# Altium schematic sheet RcMPPT-Debug.SchDoc: RcMPPT-Debug
size A4; Author: Thomas Hofmann; CompanyName: HTL St. Pölten; Organization: Altium Limited; Address1: RcMPPT; Address2: Frenchs Forest; Address3: NSW; Address4: Australia 2086; DocumentNumber: 6; Revision: 2.0; SheetNumber: 6; SheetTotal: 8
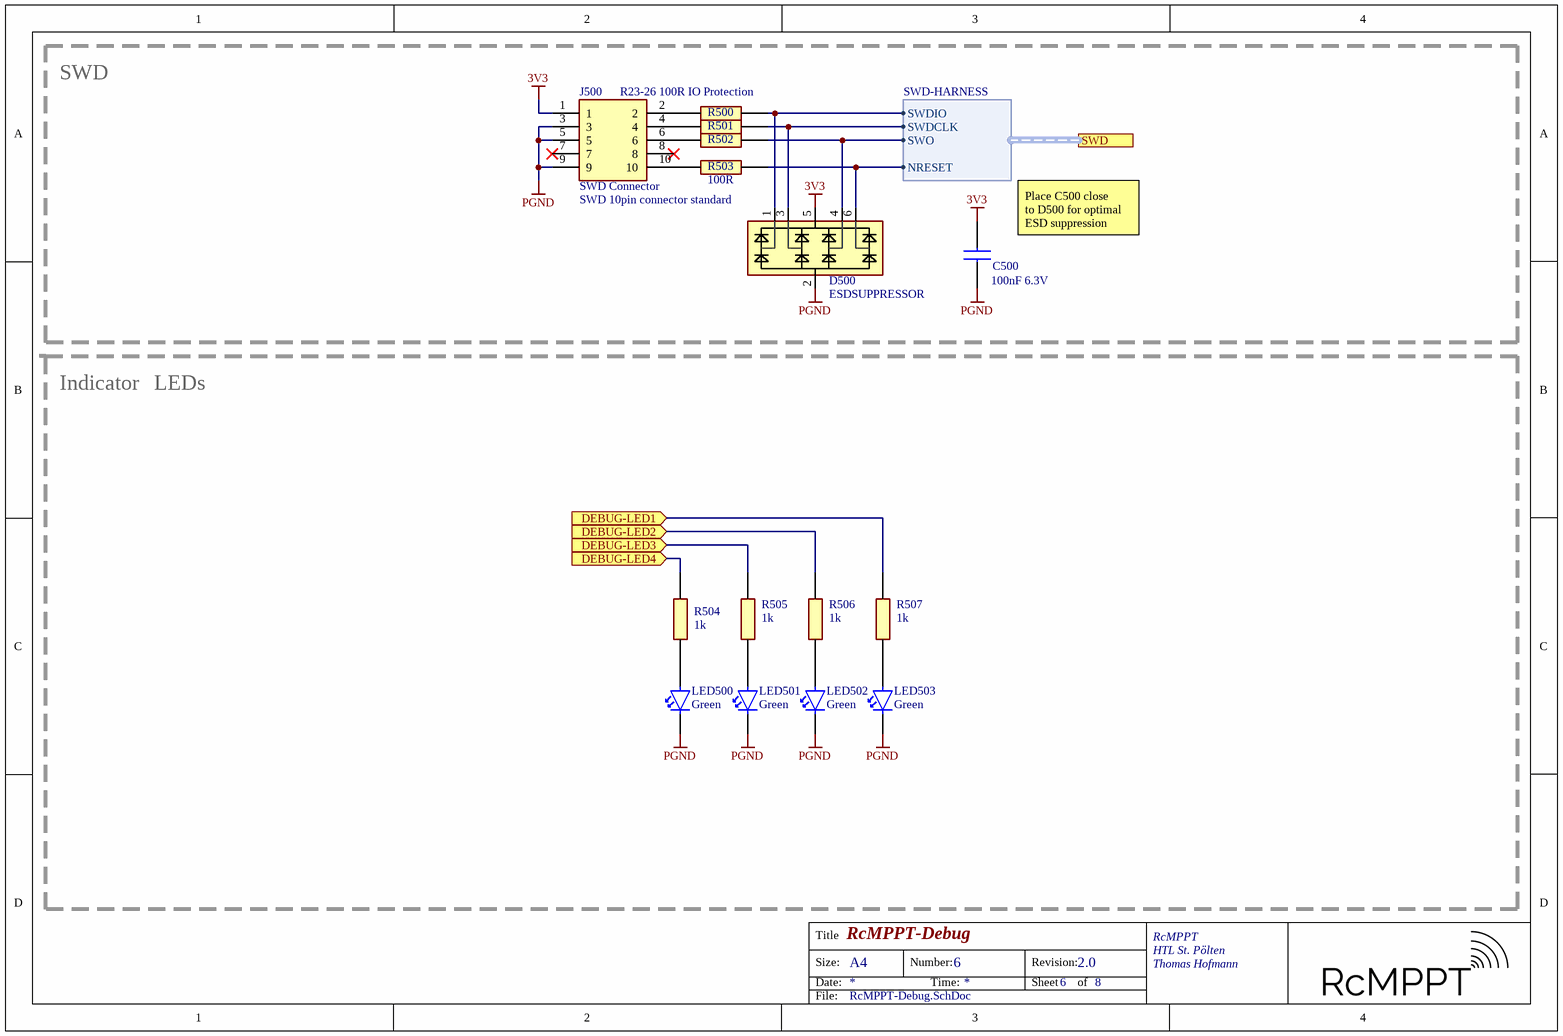
[diagram p0: RcMPPT-Debug.SchDoc]

## Parts
C500  100nF 6.3V  [CAPC1608X97N]
D500  ESDSUPPRESSOR  [SOT23-6]
J500  SWD Connector  [HUSSP10W40P127_2X5_635X340X420P]
LED500  Green  [CHIPLED_0603]
LED501  Green  [CHIPLED_0603]
LED502  Green  [CHIPLED_0603]
LED503  Green  [CHIPLED_0603]
R500  100R  [RESC1005X40N]  (value not drawn)
R501  100R  [RESC1005X40N]  (value not drawn)
R502  100R  [RESC1005X40N]  (value not drawn)
R503  100R  [RESC1005X40N]
R504  1k  [RESC1608X50N]
R505  1k  [RESC1608X50N]
R506  1k  [RESC1608X50N]
R507  1k  [RESC1608X50N]

## Blocks framed on the sheet
SWD: C500 D500 J500 R500-R503

## Ports
DEBUG-LED1 (in), DEBUG-LED2 (in), DEBUG-LED3 (in), DEBUG-LED4 (in), SWD (harness SWD-HARNESS)

## Harnesses
SWD-HARNESS: SWDIO, SWDCLK, SWO, NRESET

## Nets
3V3: C500.2 D500.5(VDD) J500.1
PGND: C500.1 D500.2(GND) J500.3 J500.5 J500.9 LED500.1(K) LED501.1(K) LED502.1(K) LED503.1(K)
DEBUG-LED1: R507.1 ; port DEBUG-LED1
DEBUG-LED2: R506.1 ; port DEBUG-LED2
DEBUG-LED3: R505.1 ; port DEBUG-LED3
DEBUG-LED4: R504.1 ; port DEBUG-LED4
NetD500_1: D500.1(CH1) R500.2 ; port SWD.SWDIO
NetD500_3: D500.3(CH2) R501.2 ; port SWD.SWDCLK
NetD500_4: D500.4(CH3) R502.2 ; port SWD.SWO
NetD500_6: D500.6(CH4) R503.2 ; port SWD.NRESET
NetJ500_2: J500.2 R500.1
NetJ500_4: J500.4 R501.1
NetJ500_6: J500.6 R502.1
NetJ500_10: J500.10 R503.1
NetLED500_2: LED500.2(A) R504.2
NetLED501_2: LED501.2(A) R505.2
NetLED502_2: LED502.2(A) R506.2
NetLED503_2: LED503.2(A) R507.2

Not connected (* = marked no-connect by the designer): J500 7* 8*

## Notes on the sheet
- R23-26 100R IO Protection
- SWD 10pin connector standard
- (near C500) Place C500 close
  to D500 for optimal
  ESD suppression
- Indicator
- LEDs
- Title
- Size:
- Date:
- A4
- Number:
- Time:
- Revision:
- Sheet
- of
- RcMPPT
- File:

## Library data of the parts
C500 = C0603: Capacitor; Height: 0.97
D500 = ESDSUPPRESSOR: TVS Diode Array; Height: 0.6mm
J500 = M50-3600542R: Connector; Manufacturer_Name: Harwin; Datasheet Link: https://cdn.harwin.com/pdfs/M50-360R.pdf; Manufacturer_Part_Number: M50-3600542R; Mouser Part Number: 855-M50-3600542R; Mouser Price/Stock: https://www.mouser.co.uk/ProductDetail/Harwin/M50-3600542R?qs=DVxm2sPGGrrPu%2FxuhpV3yw%3D%3D
LED500-LED503 = CHIPLED0603: LED; Mouser Price/Stock: https://www.mouser.at/c/optoelectronics/led-lighting/led-emitters/standard-leds-smd/?series=CHIPLED%200603&instock=y
R500-R503 = R0402: Resistor; Height: 0.4mm
R504-R507 = R0603: Resistor; Height: 0.55mm